# Altium schematic sheet LAUNCHXL-F28379D_9.SchDoc
size 301 x 239 mm
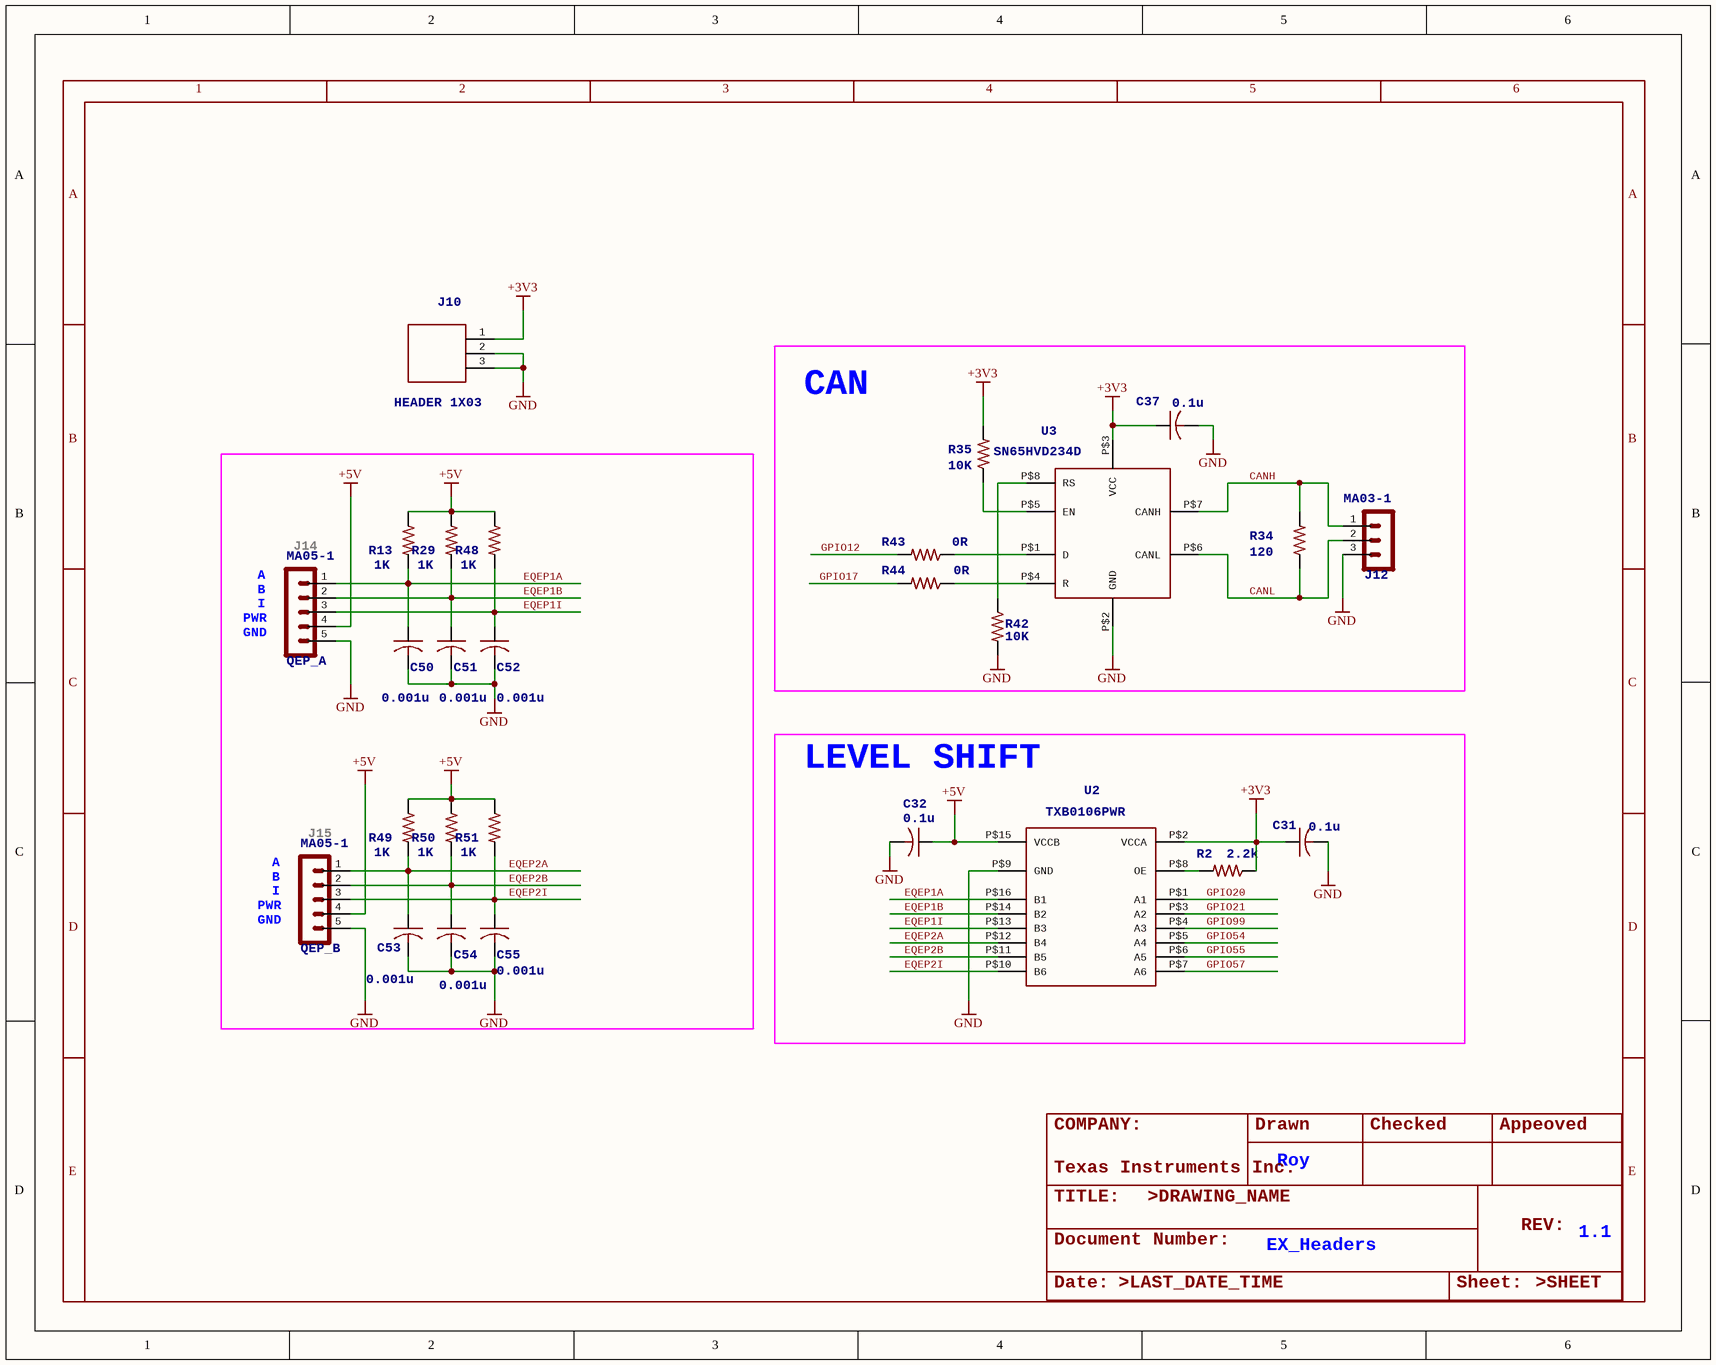
[diagram p0: LAUNCHXL-F28379D_9.SchDoc]

## Parts
C31  0.1u  [C0402]
C32  0.1u  [C0402]
C37  0.1u  [C0402]
C50  0.001u  [C0402]
C51  0.001u  [C0402]
C52  0.001u  [C0402]
C53  0.001u  [C0402]
C54  0.001u  [C0402]
C55  0.001u  [C0402]
J10  HEADER 1X03  [3PIN_PWR_3V3]
J12  MA03-1  [MA03-1]
QEP_A  MA05-1  [MA05-1]
QEP_B  MA05-1  [MA05-1]
R2  2.2k  [R0402]
R13  1K  [R0402]
R29  1K  [R0402]
R34  120  [R0402]
R35  10K  [R0402]
R42  10K  [R0402]
R43  0R  [R0402]
R44  0R  [R0402]
R48  1K  [R0402]
R49  1K  [R0402]
R50  1K  [R0402]
R51  1K  [R0402]
U2  TXB0106PWR  [TSSOP16-PW]
U3  SN65HVD234D  [SOIC8-PDSO]

## Blocks framed on the sheet
CAN: C37 J12 R34 R35 R42-R44 U3
LEVEL SHIFT: C31 C32 R2 U2

## Nets
+3V3: C31.1 C37.1 J10.1 R2.1 R35.2 U2.P$2(VCCA) U3.P$3(VCC)
+5V: C32.1 QEP_A.4 QEP_B.4 R13.1 R29.1 R48.1 R49.1 R50.1 R51.1 U2.P$15(VCCB)
GND: C31.2 C32.2 C37.2 C50.2 C51.2 C52.2 C53.2 C54.2 C55.2 J10.2 J10.3 J12.3 QEP_A.5 QEP_B.5 R42.2 U2.P$9(GND) U3.P$2(GND)
CANH: J12.1 R34.2 U3.P$7(CANH)
CANL: J12.2 R34.1 U3.P$6(CANL)
EQEP1A: C50.1 QEP_A.1 R13.2 U2.P$16(B1)
EQEP1B: C51.1 QEP_A.2 R29.2 U2.P$14(B2)
EQEP1I: C52.1 QEP_A.3 R48.2 U2.P$13(B3)
EQEP2A: C53.1 QEP_B.1 R49.2 U2.P$12(B4)
EQEP2B: C54.1 QEP_B.2 R50.2 U2.P$11(B5)
EQEP2I: C55.1 QEP_B.3 R51.2 U2.P$10(B6)
GPIO12: R43.2
GPIO17: R44.2
GPIO20: U2.P$1(A1)
GPIO21: U2.P$3(A2)
GPIO54: U2.P$5(A4)
GPIO55: U2.P$6(A5)
GPIO57: U2.P$7(A6)
GPIO99: U2.P$4(A3)
NetR2_2: R2.2 U2.P$8(OE)
NetR35_1: R35.1 U3.P$5(EN)
NetR42_1: R42.1 U3.P$8(RS)
NetR43_1: R43.1 U3.P$1(D)
NetR44_1: R44.1 U3.P$4(R)

## Notes on the sheet
- (near QEP_A) A
- (near QEP_A) B
- (near QEP_A) J14
- (near QEP_A) GND
- (near QEP_A) PWR
- (near QEP_A) I
- (near QEP_B) A
- (near QEP_B) B
- (near QEP_B) J15
- (near QEP_B) GND
- (near QEP_B) PWR
- (near QEP_B) I
- COMPANY:
- Texas
  Instruments Inc.
- Drawn
- Roy
- Checked
- Appeoved
- TITLE:
- Document Number:
- >DRAWING_NAME
- REV:
- 1.1
- Date:
- >LAST_DATE_TIME
- EX_Headers
- Sheet:
- >SHEET
- 1
- 2
- 3
- 4
- 5
- 6
- C
- D
- E

## Library data of the parts
C31 C32 C37 C50-C55 = C-USC0402: <B>CAPACITOR</B>, American symbol
J10 = BP_HEADERS_PWR_3V3-TH
J12 = MA03-1: <b>PIN HEADER</b>
QEP_A QEP_B = MA05-1: <b>PIN HEADER</b>
R2 R13 R29 R34 R35 R42-R44 R48-R51 = R-US_R0402: <B>RESISTOR</B>, American symbol